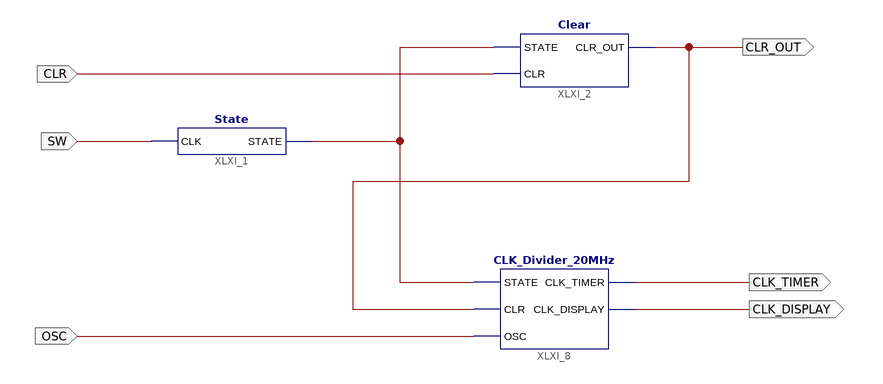
[diagram p0: schematic sheet 1]
// Xilinx ISE schematic Control.sch (spartan6) as structural Verilog: 3 symbols, 6 ports
module Control (
  input  CLR,
  input  SW,
  input  OSC,
  output CLK_TIMER,
  output CLK_DISPLAY,
  output CLR_OUT
);

  wire XLXN_6;

  State XLXI_1 (.CLK(SW), .STATE(XLXN_6));
  Clear XLXI_2 (.CLR(CLR), .CLR_OUT(CLR_OUT), .STATE(XLXN_6));
  CLK_Divider_20MHz XLXI_8 (.CLK_DISPLAY(CLK_DISPLAY), .CLK_TIMER(CLK_TIMER), .CLR(CLR_OUT), .OSC(OSC), .STATE(XLXN_6));
endmodule
